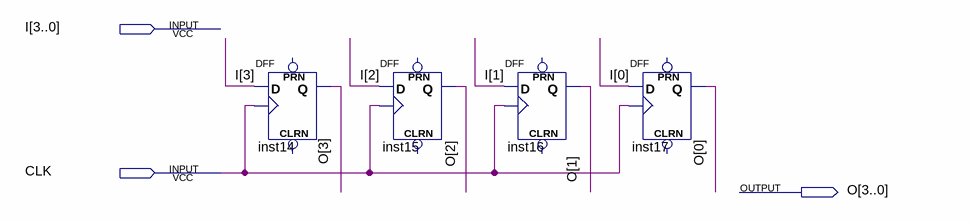
[diagram p0: schematic sheet]
// Quartus schematic Reg1x4.bdf as structural Verilog: 4 symbols, 3 pins
module Reg1x4 (
  input  [3:0] I,
  input  CLK,
  output [3:0] O
);

  DFF inst14 (.CLK(CLK), .D(I[3]), .Q(O[3]));  // open: CLRN, PRN
  DFF inst15 (.CLK(CLK), .D(I[2]), .Q(O[2]));  // open: CLRN, PRN
  DFF inst16 (.CLK(CLK), .D(I[1]), .Q(O[1]));  // open: CLRN, PRN
  DFF inst17 (.CLK(CLK), .D(I[0]), .Q(O[0]));  // open: CLRN, PRN
endmodule
